# Altium schematic sheet Peripherals - MyoSensor.SchDoc
size 420 x 297 mm; SheetNumber: 6; SheetTotal: 7
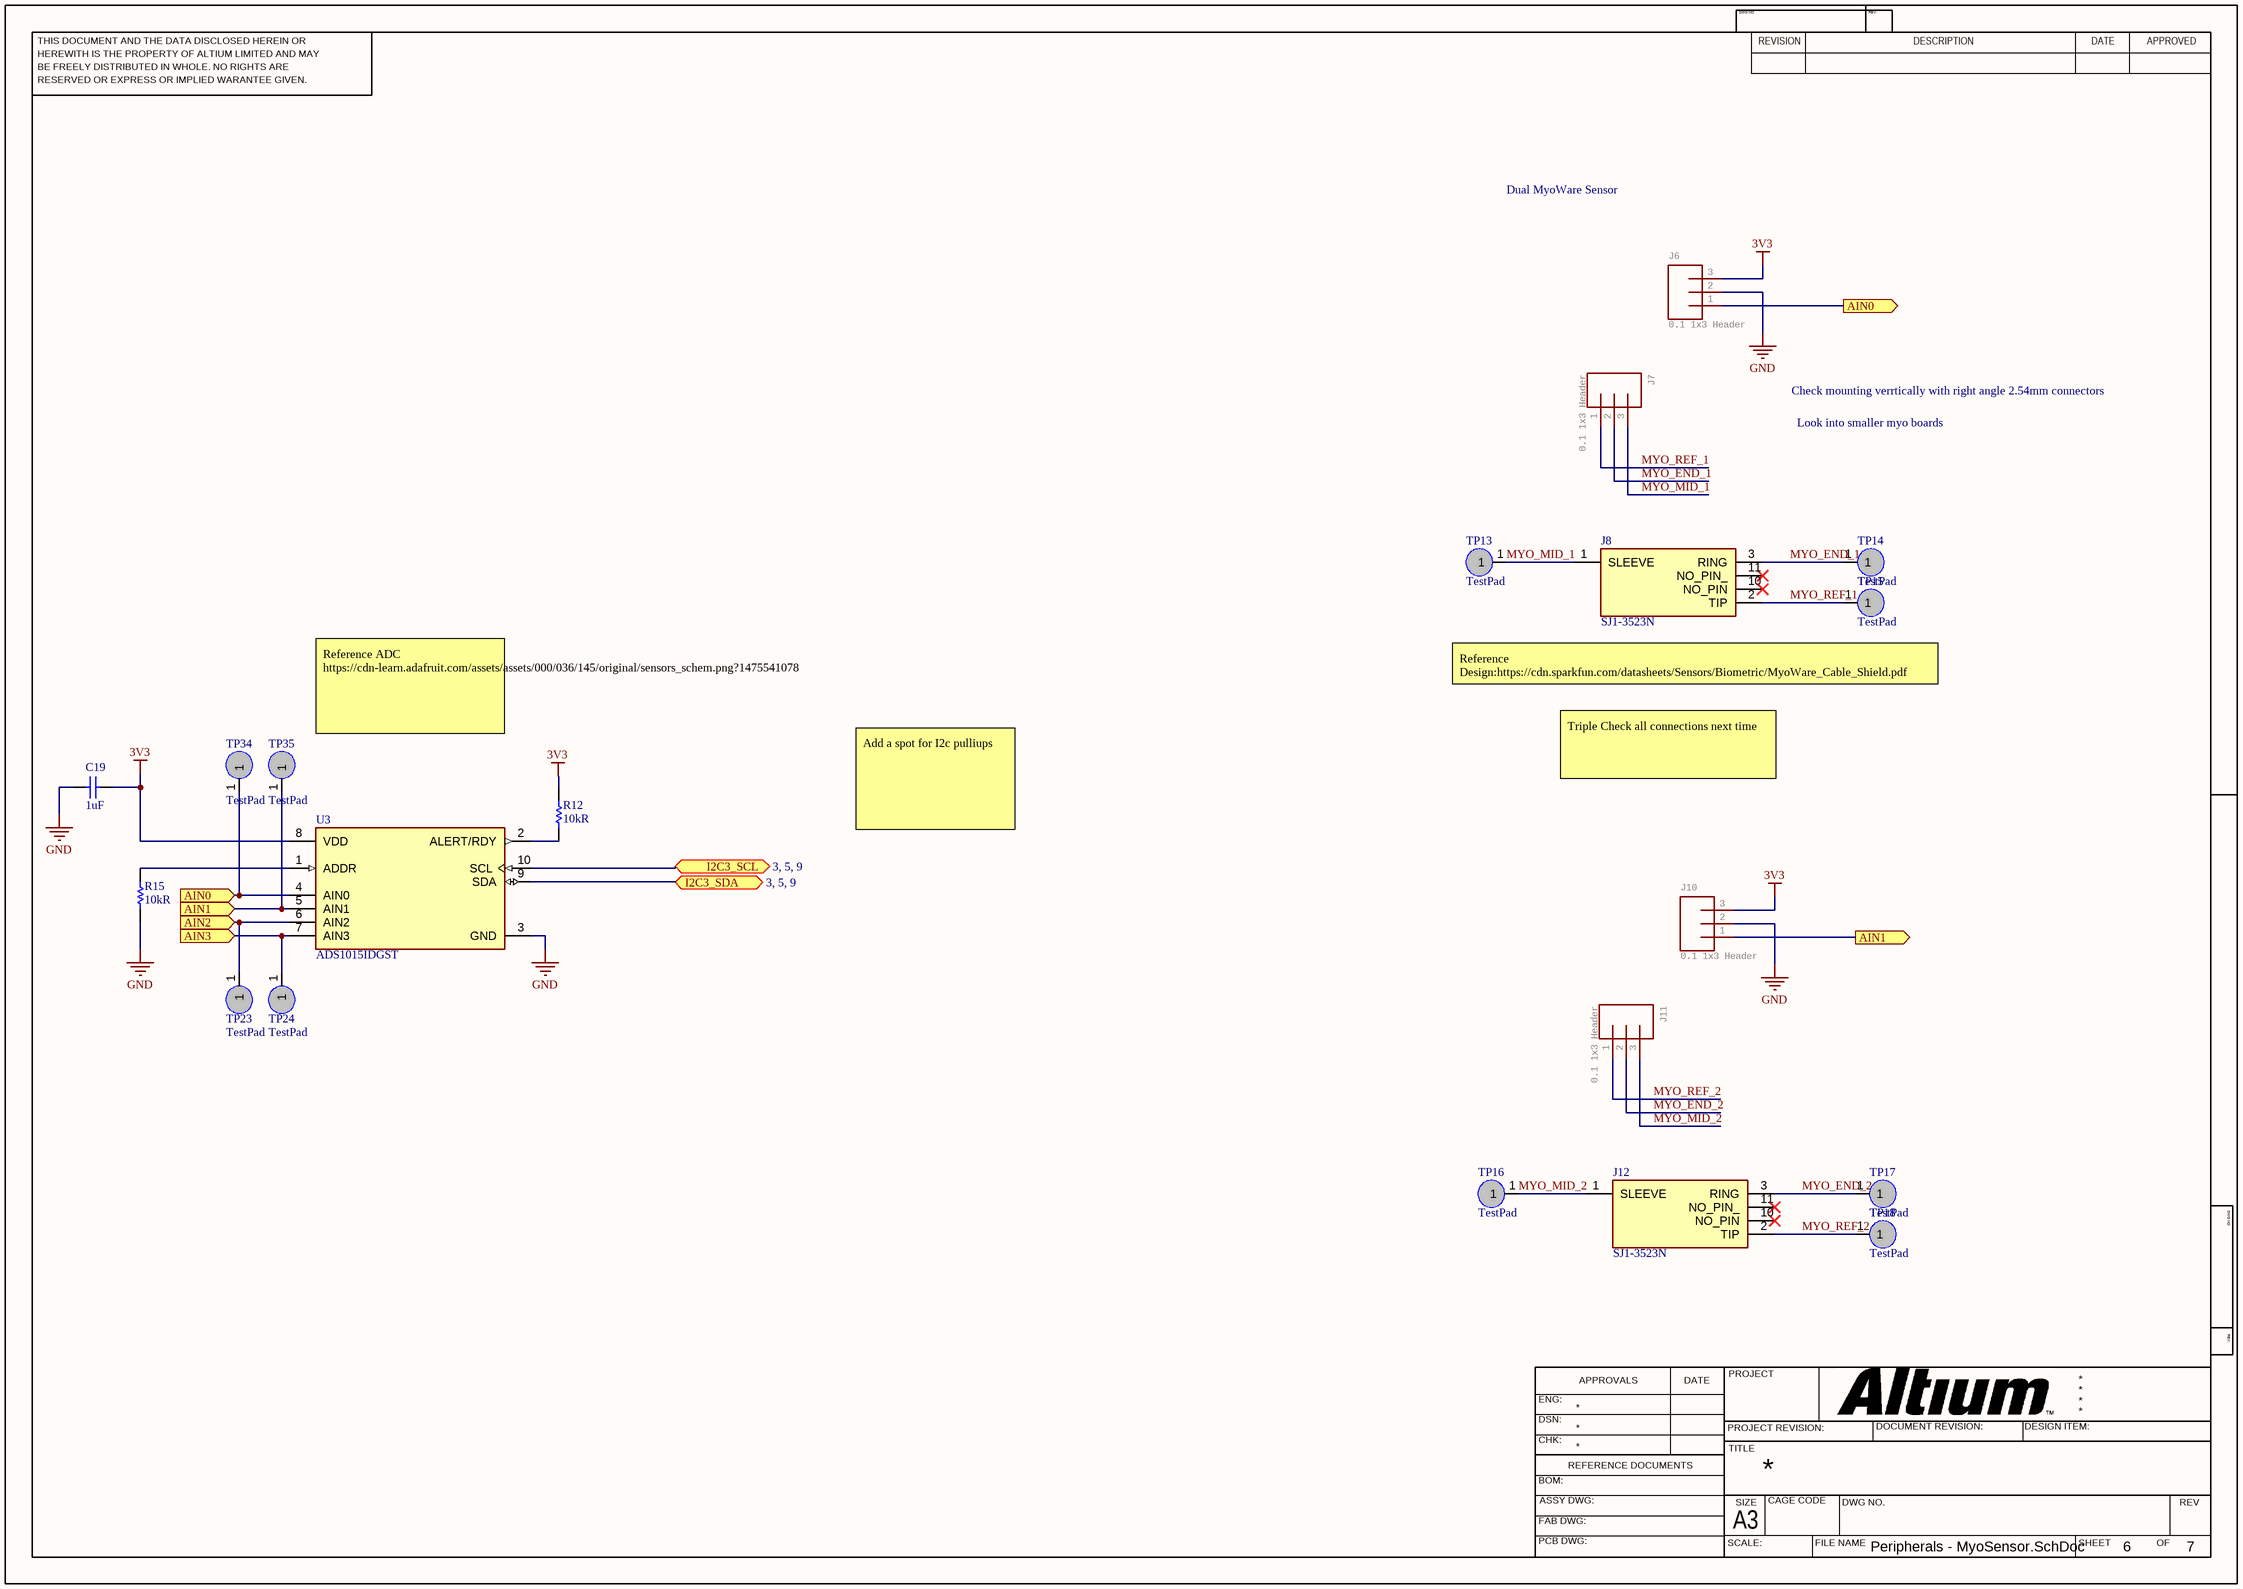
[diagram p0: Peripherals - MyoSensor.SchDoc]

## Parts
C19  1uF  [CAPC2013X145X50LL20T25]
J6  0.1 1x3 Header  [1X03]
J7  0.1 1x3 Header  [1X03]
J8  SJ1-3523N  [SJ13523N]
J10  0.1 1x3 Header  [1X03]
J11  0.1 1x3 Header  [1X03]
J12  SJ1-3523N  [SJ13523N]
R12  10kR  [RESC2013X60X35NL10T20]
R15  10kR  [RESC2013X60X35NL10T20]
TP13  TestPad  [TestPad50mil]
TP14  TestPad  [TestPad50mil]
TP15  TestPad  [TestPad50mil]
TP16  TestPad  [TestPad50mil]
TP17  TestPad  [TestPad50mil]
TP18  TestPad  [TestPad50mil]
TP23  TestPad  [TestPad50mil]
TP24  TestPad  [TestPad50mil]
TP34  TestPad  [TestPad50mil]
TP35  TestPad  [TestPad50mil]
U3  ADS1015IDGST  [FP-DGS0010A-MFG]

## Ports
AIN0 (in), AIN0 (out), AIN1 (in), AIN1 (out), AIN2 (in), AIN3 (in), I2C3_SCL (bidir, see 3, 5, 9), I2C3_SDA (bidir, see 3, 5, 9)

## Nets
3V3: C19.2 J6.3 J10.3 R12.2 U3.8(VDD)
GND: C19.1 J6.2 J10.2 R15.1 U3.3(GND)
AIN0: J6.1 TP34.1 U3.4(AIN0) ; port AIN0
AIN1: J10.1 TP35.1 U3.5(AIN1) ; port AIN1
AIN2: TP23.1 U3.6(AIN2) ; port AIN2
AIN3: TP24.1 U3.7(AIN3) ; port AIN3
I2C3_SCL: U3.10(SCL) ; port I2C3_SCL
I2C3_SDA: U3.9(SDA) ; port I2C3_SDA
MYO_END_1: J7.2 J8.3(RING) TP14.1
MYO_END_2: J11.2 J12.3(RING) TP17.1
MYO_MID_1: J7.3 J8.1(SLEEVE) TP13.1
MYO_MID_2: J11.3 J12.1(SLEEVE) TP16.1
MYO_REF_1: J7.1 J8.2(TIP) TP15.1
MYO_REF_2: J11.1 J12.2(TIP) TP18.1
NetR12_1: R12.1 U3.2(ALERT/RDY)
NetR15_2: R15.2 U3.1(ADDR)

Not connected (* = marked no-connect by the designer): J8 10(NO_PIN)* 11(NO_PIN_)*; J12 10(NO_PIN)* 11(NO_PIN_)*

## Notes on the sheet
- Dual MyoWare Sensor
- Check mounting verrtically with right angle 2.54mm connectors
- Look into smaller myo boards
- Reference ADC
  https://cdn-learn.adafruit.com/assets/assets/000/036/145/original/sensors_schem.png?1475541078
- Reference Design:https://cdn.sparkfun.com/datasheets/Sensors/Biometric/MyoWare_Cable_Shield.pdf
- Triple Check all connections next time
- Add a spot for I2c pulliups
- THIS DOCUMENT AND THE DATA DISCLOSED HEREIN OR
- HEREWITH IS THE PROPERTY OF ALTIUM LIMITED AND MAY
- DWG NO:
- REVISION
- REV:
- DESCRIPTION
- DATE
- APPROVED
- BE FREELY DISTRIBUTED IN WHOLE. NO RIGHTS ARE
- RESERVED OR EXPRESS OR IMPLIED WARANTEE GIVEN.
- ENG:
- APPROVALS
- PROJECT
- DSN:
- CHK:
- REFERENCE DOCUMENTS
- PROJECT REVISION:
- TITLE
- DOCUMENT REVISION:
- DESIGN ITEM:
- BOM:
- FAB DWG:
- PCB DWG:
- ASSY DWG:
- SCALE:
- A3
- SIZE
- CAGE CODE
- FILE NAME
- DWG NO.
- SHEET
- OF
- REV

## Library data of the parts
C19 = CMP-1036-04746-2: C0805C105K4PACTU; Manufacturer: Kemet; Part Number: C0805C105K4PACTU
J6 J7 J10 J11 = CONN_03: GateName_1: J$1; PROD_ID: XXX-00000; SymbolName_1: CONN_03; LibraryName: SparkFun-Connectors; DeviceSetName: CONN_03; Package: 1X03
J8 J12 = SJ1-3523N: Connector; Manufacturer_Name: CUI Inc.; Datasheet Link: https://componentsearchengine.com/Datasheets/1/SJ1-3523N.pdf; Height: 5.5mm; Manufacturer_Part_Number: SJ1-3523N; Mouser Part Number: 490-SJ1-3523N; Mouser Price/Stock: https://www.mouser.co.uk/ProductDetail/CUI-Devices/SJ1-3523N?qs=WyjlAZoYn50aNl0vAhb3Tg%3D%3D; Arrow Part Number: SJ1-3523N; Arrow Price/Stock: https://www.arrow.com/en/products/sj1-3523n/cui-devices
R12 R15 = CMP-1659-00013-4: RC0805FR-0710KL Chip Resistor, 10 KOhm, +/- 1%, 0.125 W, -55 to 155 degC, 0805 (2012 Metric), RoHS, Tape and Reel; Manufacturer: Yageo; Voltage Rating: 150 V; Mount: Surface Mount; ComponentLink1Description: Manufacturer URL; ComponentLink2URL: http://www.yageo.com/documents/recent/PYu-RC_Group_51_RoHS_L_04.pdf; Pins: 2; Length: 2 mm; Min Operating Temperature: -55 degC; Height: 0.5 mm; Mounting Technology: Surface Mount; RoHSCompliant: true; REACH SVHC: No SVHC; ComponentLink1URL: http://www.yageo.com/; Max Operating Temperature: 155 degC; PackageReference: 0805; DatasheetVersion: Rev. 4, 02/2016; Package Quantity: 5000; Packaging: Tape and Reel; ComponentLink2Description: Datasheet; PackageDescription: 2-Pin Surface Mounted Device, Body 2 x 1.25 mm
U3 = CMP-0003-00377-3: IC ADC 12BIT SIGMA-DELTA 10VSSOP; Supply Type: Single; Number of Converters: 1; Number of Bits: 12; Number of Inputs: 4; Sampling Rate: 3.3KS/s; Conversion Rate: 3300S/s; Min Supply Voltage: 2V; Interface: I2C; Operating Supply Voltage: 3.3V; Polarity: Bipolar; Nominal Supply Current: 150uA; Integral Nonlinearity (INL): 0.5LSB; Max Power Dissipation: 900uW; Max Supply Voltage (DC): 5.5V; Resolution: 12b; Width: 3mm; Min Operating Temperature: -40°C; Contact Plating: Gold; Number of A/D Converters: 1; Max Operating Temperature: 125°C; Height: 1.02mm; Case/Package: VSSOP; Package Quantity: 250; Number of Elements: 1; Lead Free: Lead Free; Number of Pins: 10; Radiation Hardening: No; Termination: SMD/SMT; Length: 3mm; Min Supply Voltage (DC): 2V; Power Dissipation: 900uW; Number of Channels: 4; Max Supply Voltage: 5.5V; REACH SVHC: No SVHC; Packaging: Tape and Reel